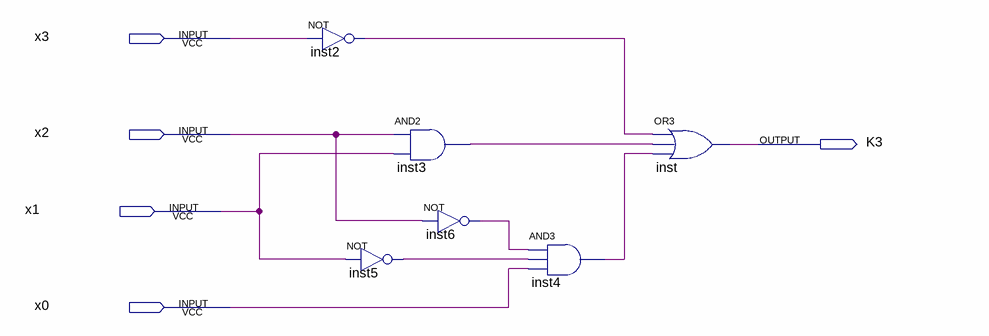
[diagram p0: schematic sheet]
// Quartus schematic K3.bdf as structural Verilog: 6 symbols, 5 pins
module K3 (
  input  x3,
  input  x2,
  input  x1,
  input  x0,
  output K3
);

  wire inst2_out, inst3_out, inst4_out, inst5_out, inst6_out;

  not inst2 (inst2_out, x3);
  not inst5 (inst5_out, x1);
  and inst3 (inst3_out, x2, x1);
  not inst6 (inst6_out, x2);
  and inst4 (inst4_out, inst6_out, inst5_out, x0);
  or inst (K3, inst2_out, inst3_out, inst4_out);
endmodule
